# EAGLE schematic AccelBreakout (EAGLE 6.5.0)
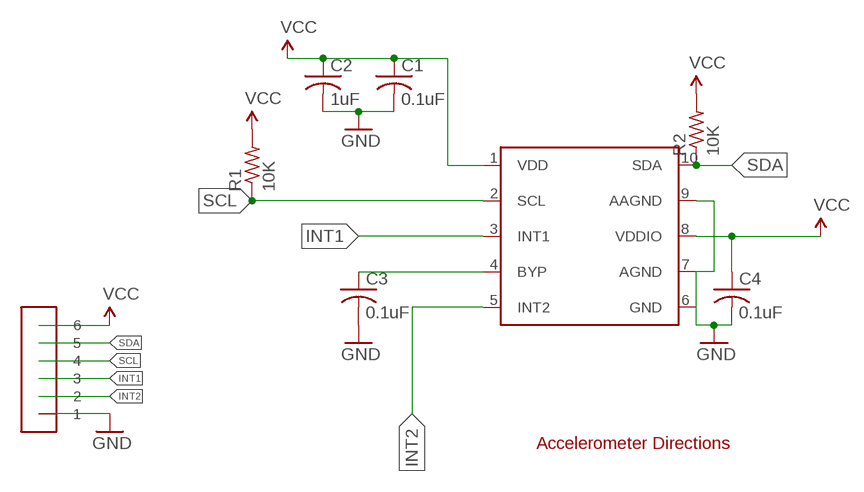
[diagram p0: schematic, sheet 1]

## Parts
C1  0.1uF  C-USC0603  [C0603]
C2  1uF  C-USC0603  [C0603]
C3  0.1uF  C-USC0603  [C0603]
C4  0.1uF  C-USC0603  [C0603]
R1  10K  R-US_R0603  [R0603]
R2  10K  R-US_R0603  [R0603]
U$1  DIP1X6MALE  [DIP1X6MALE]
U$2  ACCELDIR  [ACCELDIR]
U$23  MMA8653FCR1  [MMA8653FCR1]

## Nets
GND: C1.2 C2.2 C3.2 C4.2 U$1.1 U$23.6(GND) U$23.7(AGND) U$23.9(AAGND)
INT1: U$1.3 U$23.3(INT1)
INT2: U$1.2 U$23.5(INT2)
N$34: C3.1 U$23.4(BYP)
SCL: R1.1 U$1.4 U$23.2(SCL)
SDA: R2.1 U$1.5 U$23.10(SDA)
VCC: C1.1 C2.1 C4.1 R1.2 R2.2 U$1.6 U$23.1(VDD) U$23.8(VDDIO)

## Library data of the parts
C1-C4 = resistor:C-US: CAPACITOR, American symbol
R1 R2 = resistor:R-US_: RESISTOR, American symbol
U$1 = ScottSilver:DIP1X6MALE
U$2 = ScottSilver:ACCELDIR
U$23 = ScottSilver:MMA8653FCR1